# EasyEDA schematic schema.json
TITLE: Sheet_1; REV: 1.0; Date: 2024-05-26; Sheet: 1/1; Drawn By: ry4nw; Company: Your Company
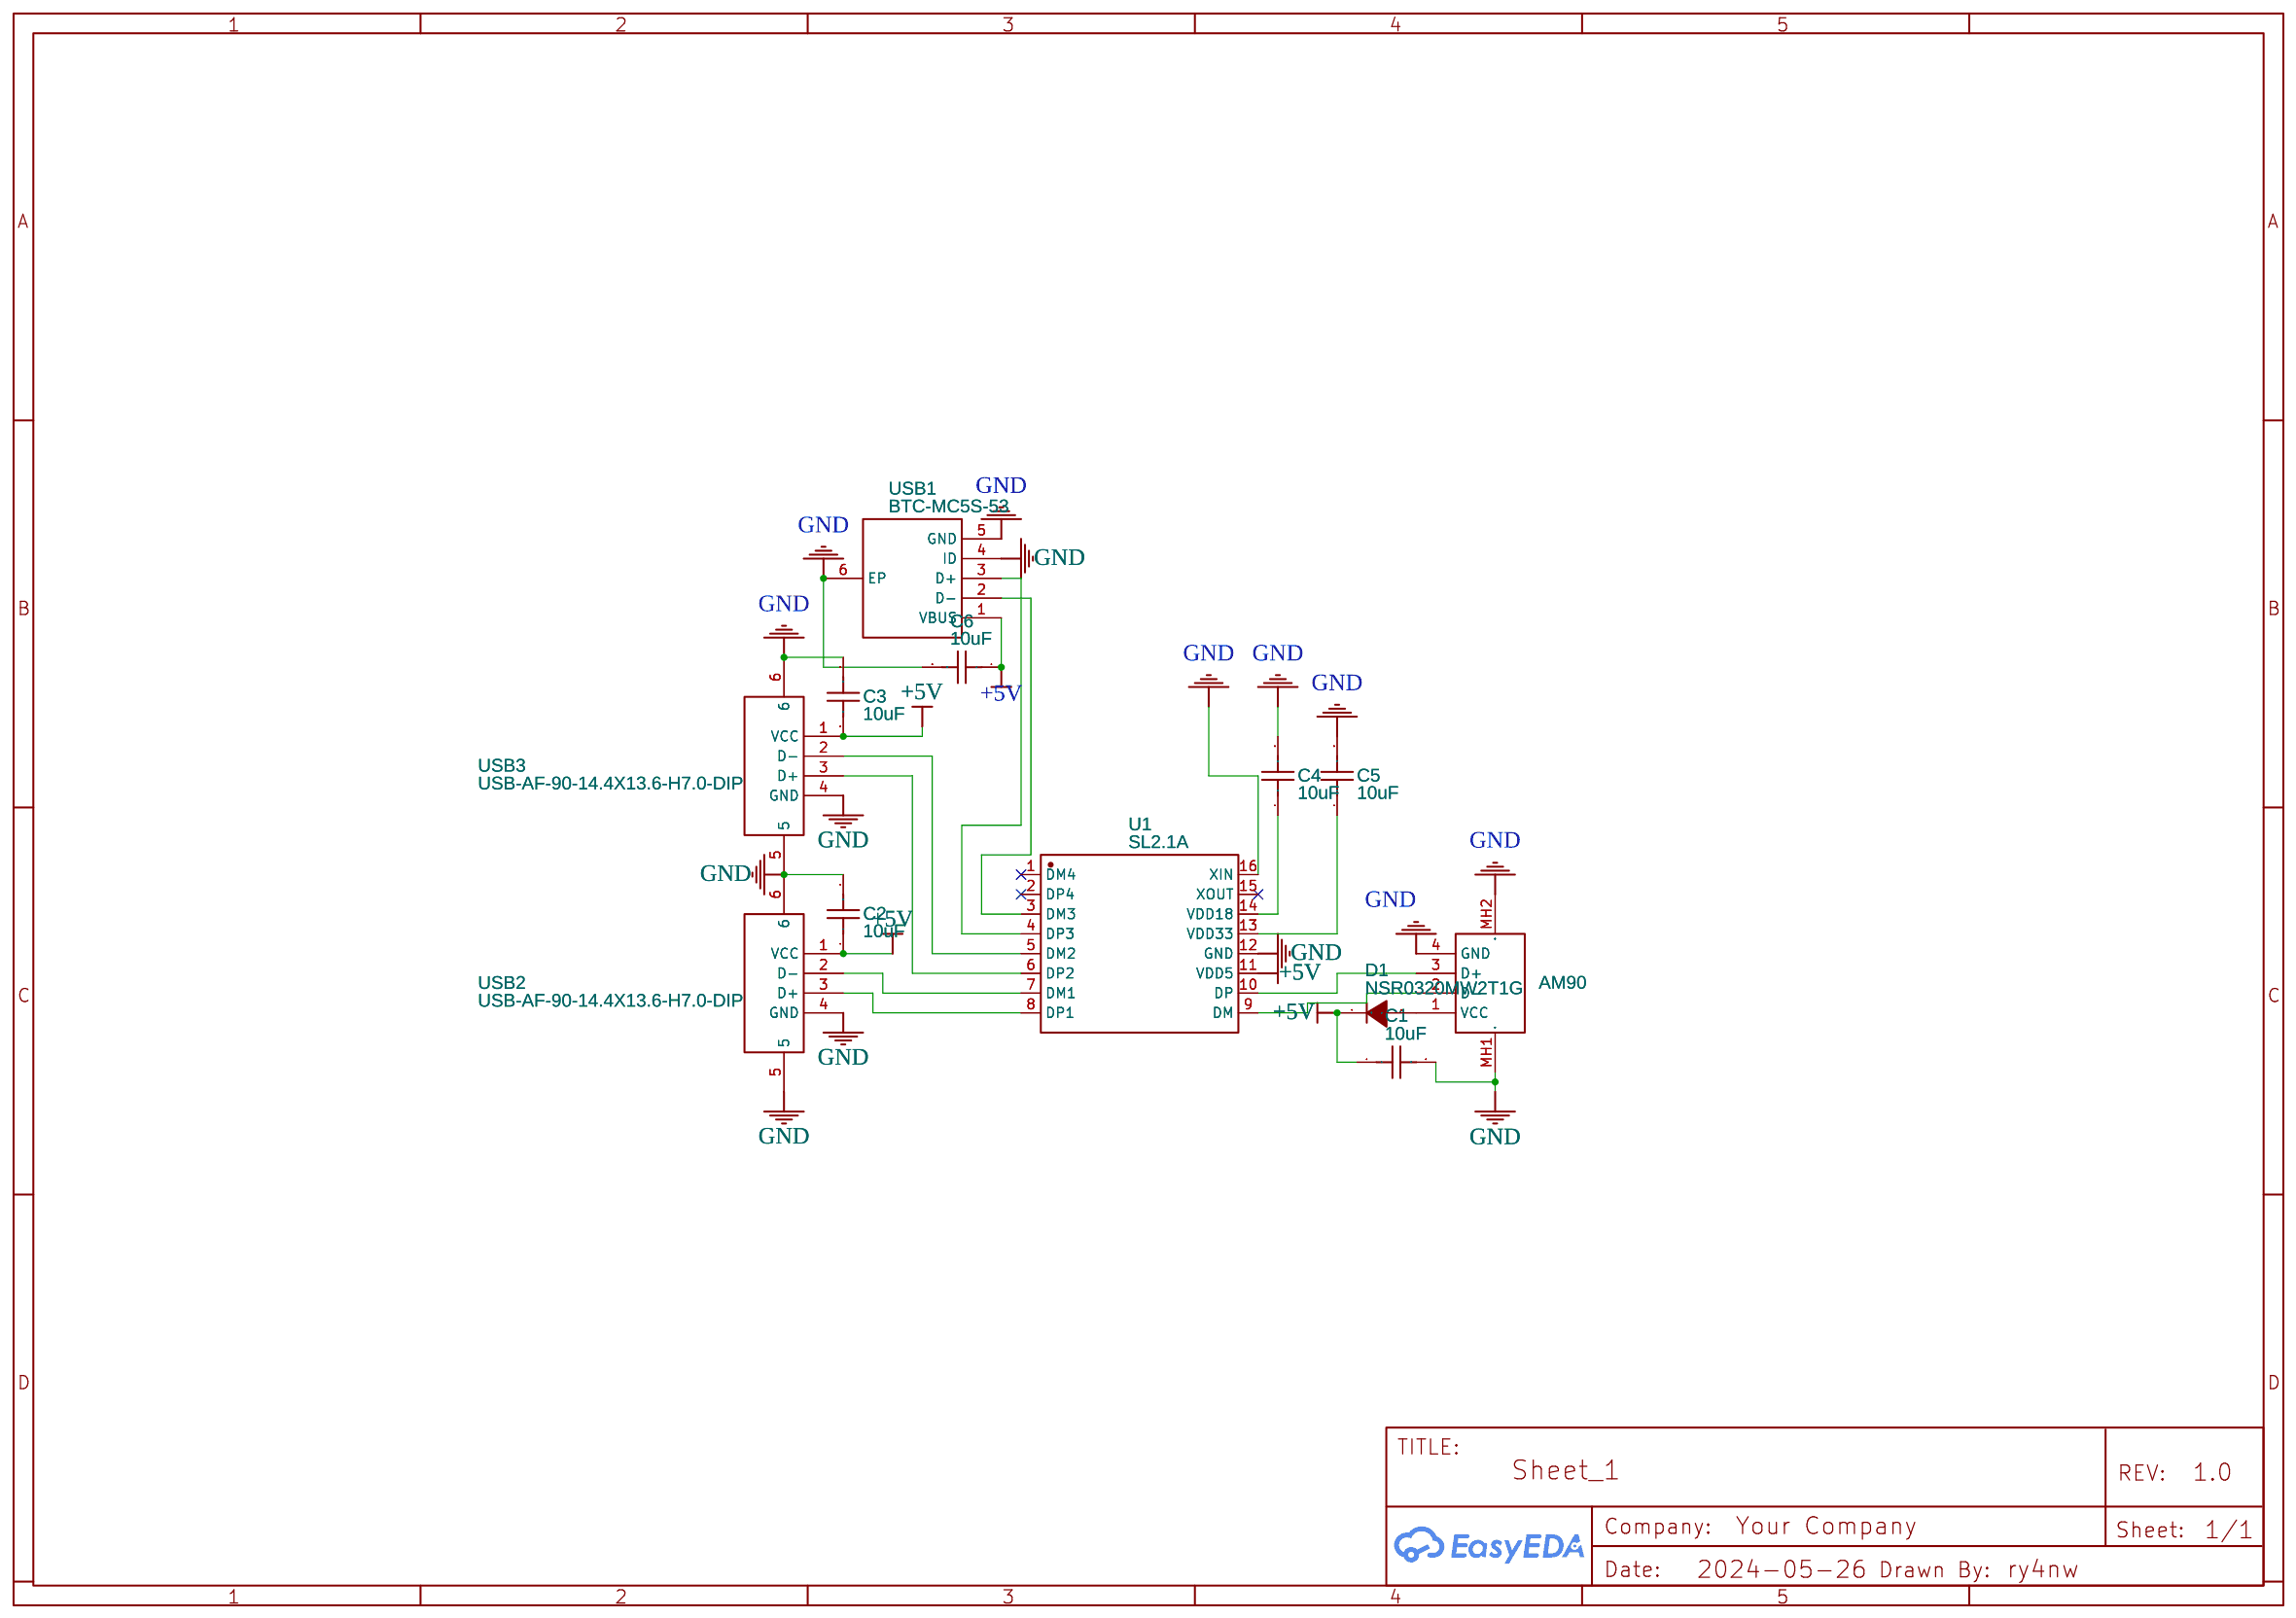
[diagram p0: schematic sheet]

## Parts
AM90  USB-MAIN  [USB-AM-TH_AM90]
C1  10uF  [C0603]
C2  10uF  [C0603]
C3  10uF  [C0603]
C4  10uF  [C0603]
C5  10uF  [C0603]
C6  10uF  [C0603]
D1  NSR0320MW2T1G  [SOD-323_L1.8-W1.3-LS2.5-RD]
U1  SL2.1A  [SOP-16_L10.0-W3.9-P1.27-LS6.0-BL]
USB1  BTC-MC5S-53  [MICRO-USB-SMD_MICRO-USB-BTC-MC5S-43]
USB2  USB-AF-90-14.4X13.6-H7.0-DIP  [USB-A-TH_C46407]
USB3  USB-AF-90-14.4X13.6-H7.0-DIP  [USB-A-TH_C46407]

## Library data of the parts
AM90 = AM90: Contributor: LCSC; Supplier: LCSC; Supplier Part: C404965; Manufacturer: SHOU HAN(首韩); JLCPCB Part Class: Extended Part
C1-C6 = CL10A106KP8NNNC: Supplier: LCSC; Manufacturer: SAMSUNG(三星); Supplier Part: C19702; JLCPCB Part Class: Basic Part
D1 = NSR0320MW2T1G: Supplier: LCSC; Manufacturer: onsemi(安森美); Supplier Part: C48192; JLCPCB Part Class: Extended Part
U1 = SL2.1A: Contributor: LCSC; Supplier: LCSC; Supplier Part: C192893; Manufacturer: CoreChips(和芯润德); JLCPCB Part Class: Extended Part
USB1 = BTC-MC5S-53: Contributor: LCSC; Supplier: LCSC; Supplier Part: C2908216; Manufacturer: DGBZ(东莞博众); JLCPCB Part Class: Extended Part
USB2 USB3 = USB-AF-90-14.4X13.6-H7.0-DIP: Contributor: LCSC; Supplier: LCSC; Supplier Part: C46407; Manufacturer: 精拓金; Manufacturer Part: 903-131A1011D10100; JLCPCB Part Class: Extended Part

## Nets
+5V: C1.1 C2.1 C3.1 C6.1 D1.1(C) U1.11(VDD5) USB1.1(VBUS) USB2.1(VCC) USB3.1(VCC)
GND: AM90.4(GND) AM90.MH1 AM90.MH2 C1.2 C2.2 C3.2 C4.2 C5.2 C6.2 U1.12(GND) U1.16(XIN) USB1.4(ID) USB1.5(GND) USB1.6(EP) USB2.4(GND) USB2.5 USB2.6 USB3.4(GND) USB3.5 USB3.6
Net-(AM90-1): AM90.1(VCC) D1.2(A)
Net-(AM90-2): AM90.2(D-) U1.9(DM)
Net-(AM90-3): AM90.3(D+) U1.10(DP)
Net-(C4-1): C4.1 U1.14(VDD18)
Net-(C5-1): C5.1 U1.13(VDD33)
Net-(U1-3): U1.3(DM3) USB1.2(D-)
Net-(U1-4): U1.4(DP3) USB1.3(D+)
Net-(U1-5): U1.5(DM2) USB3.2(D-)
Net-(U1-6): U1.6(DP2) USB3.3(D+)
Net-(U1-7): U1.7(DM1) USB2.2(D-)
Net-(U1-8): U1.8(DP1) USB2.3(D+)

Not connected (* = marked no-connect by the designer): U1 1(DM4)* 2(DP4)* 15(XOUT)*
